# EAGLE schematic haasoscope_pro_input_board (EAGLE 9.6.2)
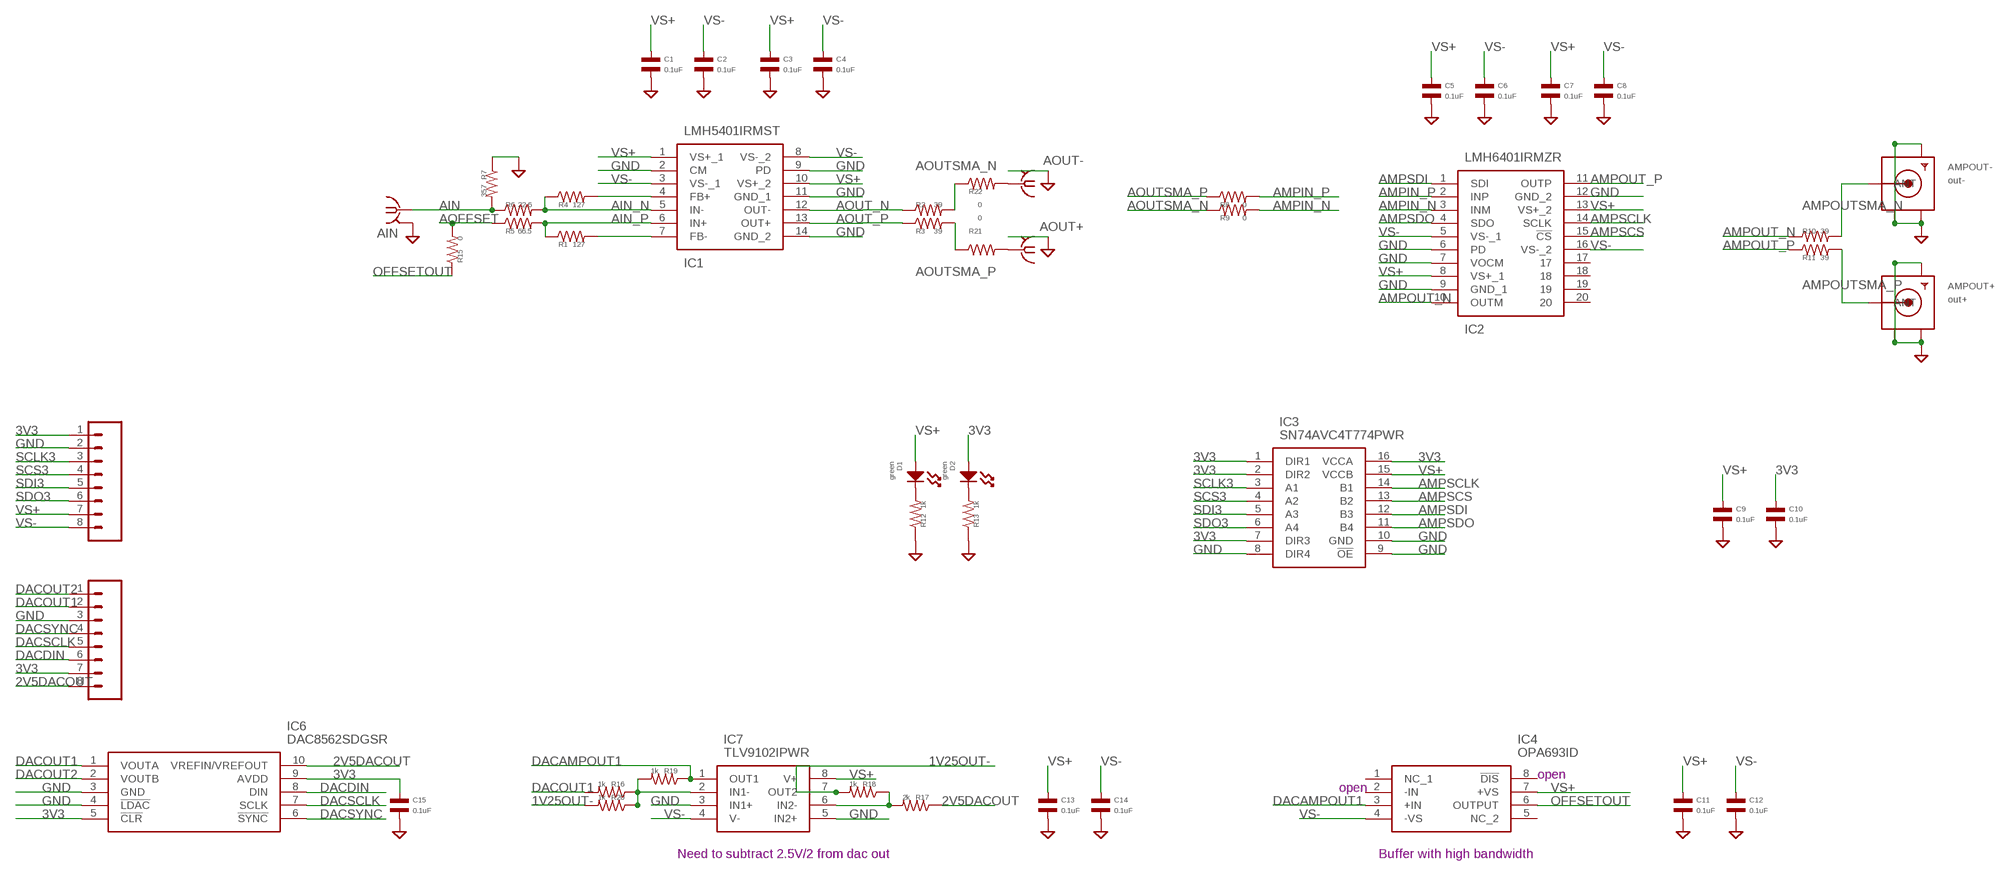
[diagram p0: schematic, sheet 1]

## Parts
AIN  BU-SMB-V  [BU-SMB-V]
AMPOUT+  out+  SMACONNECTOR_EDGE  [SMA_EDGELAUNCH]
AMPOUT-  out-  SMACONNECTOR_EDGE  [SMA_EDGELAUNCH]
AOUT+  BU-SMB-V  [BU-SMB-V]
AOUT-  BU-SMB-V  [BU-SMB-V]
C1  0.1uF  CAPACITOR_NP_0402  [C0402]
C2  0.1uF  CAPACITOR_NP_0402  [C0402]
C3  0.1uF  CAPACITOR_NP_0402  [C0402]
C4  0.1uF  CAPACITOR_NP_0402  [C0402]
C5  0.1uF  CAPACITOR_NP_0402  [C0402]
C6  0.1uF  CAPACITOR_NP_0402  [C0402]
C7  0.1uF  CAPACITOR_NP_0402  [C0402]
C8  0.1uF  CAPACITOR_NP_0402  [C0402]
C9  0.1uF  CAPACITOR_NP_0402  [C0402]
C10  0.1uF  CAPACITOR_NP_0402  [C0402]
C11  0.1uF  CAPACITOR_NP_0402  [C0402]
C12  0.1uF  CAPACITOR_NP_0402  [C0402]
C13  0.1uF  CAPACITOR_NP_0402  [C0402]
C14  0.1uF  CAPACITOR_NP_0402  [C0402]
C15  0.1uF  CAPACITOR_NP_0402  [C0402]
D1  green  LED_SINGLE-0603  [LED0603]
D2  green  LED_SINGLE-0603  [LED0603]
IC1  LMH5401IRMST  [LMH5401IRMSR]
IC2  LMH6401IRMZR  [LMH6401IRMZR]
IC3  SN74AVC4T774PWR  [SOP65P640X120-16N]
IC4  OPA693ID  [SOIC127P600X175-8N]
IC6  DAC8562SDGSR  [SOP50P490X110-10N]
IC7  TLV9102IPWR  [SOP65P640X120-8N]
J1  8pin  CONN_08"  [1X08]
J4  8pin  CONN_08"  [1X08]
R1  127  RESISTOR_0402  [R0402]
R2  39  RESISTOR_0402  [R0402]
R3  39  RESISTOR_0402  [R0402]
R4  127  RESISTOR_0402  [R0402]
R5  66.5  RESISTOR_0402  [R0402]
R6  22.6  RESISTOR_0402  [R0402]
R7  357  RESISTOR_0402  [R0402]
R8  0  RESISTOR_0402  [R0402]
R9  0  RESISTOR_0402  [R0402]
R10  39  RESISTOR_0402  [R0402]
R11  39  RESISTOR_0402  [R0402]
R12  1k  RESISTOR_0402  [R0402]
R13  1k  RESISTOR_0402  [R0402]
R15  0  RESISTOR_0402  [R0402]
R16  1k  RESISTOR_0402  [R0402]
R17  2k  RESISTOR_0402  [R0402]
R18  1k  RESISTOR_0402  [R0402]
R19  1k  RESISTOR_0402  [R0402]
R20  1k  RESISTOR_0402  [R0402]
R21  0  RESISTOR_0402  [R0402]
R22  0  RESISTOR_0402  [R0402]

## Nets
1V25OUT-: IC7.7(OUT2) R18.P$2 R20.P$2
2V5DACOUT: IC6.10(VREFIN/VREFOUT) J1.8 R17.P$1
3V3 [power]: C10.P$1 C15.P$1 D2.ANODE IC3.1(DIR1) IC3.2(DIR2) IC3.7(DIR3) IC3.16(VCCA) IC6.5(!CLR) IC6.9(AVDD) J1.7 J4.1
AIN: AIN.1 R6.P$1 R7.P$2
AIN_N: IC1.5(IN-) R4.P$1 R6.P$2
AIN_P: IC1.6(IN+) R1.P$1 R5.P$2
AMPIN_N: IC2.3(INM) R9.P$2
AMPIN_P: IC2.2(INP) R8.P$2
AMPOUT_N: IC2.10(OUTM) R10.P$1
AMPOUT_P: IC2.11(OUTP) R11.P$1
AMPOUTSMA_N: AMPOUT-.P(ANT) R10.P$2
AMPOUTSMA_P: AMPOUT+.P(ANT) R11.P$2
AMPSCLK: IC2.14(SCLK) IC3.14(B1)
AMPSCS: IC2.15(!CS) IC3.13(B2)
AMPSDI: IC2.1(SDI) IC3.12(B3)
AMPSDO: IC2.4(SDO) IC3.11(B4)
AOFFSET: R5.P$1 R15.P$2
AOUT_N: IC1.12(OUT-) R2.P$1
AOUT_P: IC1.13(OUT+) R3.P$1
AOUTSMA_N: R2.P$2 R9.P$1 R22.P$1
AOUTSMA_P: R3.P$2 R8.P$1 R21.P$1
DACAMPOUT1: IC4.3(+IN) IC7.1(OUT1) R19.P$1
DACDIN: IC6.8(DIN) J1.6
DACOUT1: IC6.1(VOUTA) J1.2 R16.P$2
DACOUT2: IC6.2(VOUTB) J1.1
DACSCLK: IC6.7(SCLK) J1.5
DACSYNC [power]: IC6.6(!SYNC) J1.4
GND: AIN.2 AIN.3 AIN.4 AIN.5 AMPOUT+.GND@1(GND4) AMPOUT+.GND@2(GND3) AMPOUT+.GND@3(GND2) AMPOUT+.GND@4(GND1) AMPOUT-.GND@1(GND4) AMPOUT-.GND@2(GND3) AMPOUT-.GND@3(GND2) AMPOUT-.GND@4(GND1) AOUT+.2 AOUT+.3 AOUT+.4 AOUT+.5 AOUT-.2 AOUT-.3 AOUT-.4 AOUT-.5 C1.P$2 C2.P$2 C3.P$2 C4.P$2 C5.P$2 C6.P$2 C7.P$2 C8.P$2 C9.P$2 C10.P$2 C11.P$2 C12.P$2 C13.P$2 C14.P$2 C15.P$2 IC1.2(CM) IC1.9(PD) IC1.11(GND_1) IC1.14(GND_2) IC2.6(PD) IC2.7(VOCM) IC2.9(GND_1) IC2.12(GND_2) IC3.8(DIR4) IC3.9(!OE) IC3.10(GND) IC6.3(GND) IC6.4(!LDAC) IC7.3(IN1+) IC7.5(IN2+) J1.3 J4.2 R7.P$1 R12.P$1 R13.P$1
N$1: D1.CATHODE R12.P$2
N$2: D2.CATHODE R13.P$2
N$3: IC7.2(IN1-) R16.P$1 R19.P$2 R20.P$1
N$4: AOUT-.1 R22.P$2
N$5: IC7.6(IN2-) R17.P$2 R18.P$1
N$6: AOUT+.1 R21.P$2
N$10: IC1.7(FB-) R1.P$2
N$13: IC1.4(FB+) R4.P$2
OFFSETOUT: IC4.6(OUTPUT) R15.P$1
SCLK3: IC3.3(A1) J4.3
SCS3: IC3.4(A2) J4.4
SDI3: IC3.5(A3) J4.5
SDO3: IC3.6(A4) J4.6
VS+: C1.P$1 C3.P$1 C5.P$1 C7.P$1 C9.P$1 C11.P$1 C13.P$1 D1.ANODE IC1.1(VS+_1) IC1.10(VS+_2) IC2.8(VS+_1) IC2.13(VS+_2) IC3.15(VCCB) IC4.7(+VS) IC7.8(V+) J4.7
VS-: C2.P$1 C4.P$1 C6.P$1 C8.P$1 C12.P$1 C14.P$1 IC1.3(VS-_1) IC1.8(VS-_2) IC2.5(VS-_1) IC2.16(VS-_2) IC4.4(-VS) IC7.4(V-) J4.8
Unconnected: IC2.17 IC2.18 IC2.19 IC2.20 IC4.1(NC_1) IC4.2(-IN) IC4.5(NC_2) IC4.8(!DIS)

## Notes on the sheet
- open
- open
- Need to subtract 2.5V/2 from dac out | Buffer with high bandwidth

## Library data of the parts
AIN AOUT+ AOUT- = con-coax:BU-SMB-V: FEMALE SMB CONNECTOR Radiall distributor RS 112-2993; OC_FARNELL: unknown; OC_NEWARK: unknown
AMPOUT+ AMPOUT- = adafruit:SMACONNECTOR: SMA Connector 90° DIP SMA Connector, 50 Ohm (4UConnector: 07259)
C1-C15 = MF_Passives:CAPACITOR_NP: Library: MF_Passives Description: Device for Non-Polarized Capacitors. Manufacture part number (MPN) can be added via Attributes. Check https://factory.macrofab.com/parts for the house parts list.; POPULATE: 1
D1 D2 = MF_LEDs:LED_SINGLE: Library: MF_LEDs Description: Device for Single LED Packages. Manufacture part number (MFG#) can be added via Attributes.; HOUSEPART: NO; POPULATE: 1
IC1 = LMH5401IRMST:LMH5401IRMST: Texas Instruments LMH5401IRMST, RF Amplifier Differential, 14-Pin UQFN Source: Datasheet <http://www.ti.com/lit/gpn/lmh5401>; DESCRIPTION: Texas Instruments LMH5401IRMST, RF Amplifier Differential, 14-Pin UQFN; HEIGHT: 0.6mm; MANUFACTURER_NAME: Texas Instruments; MANUFACTURER_PART_NUMBER: LMH5401IRMST; MOUSER_PART_NUMBER: 595-LMH5401IRMST; MOUSER_PRICE-STOCK: https://www.mouser.co.uk/ProductDetail/Texas-Instruments/LMH5401IRMST?qs=pV2tVPdcZ6z49pjv7lt75w%3D%3D
IC2 = LMH6401IRMZR:LMH6401IRMZR: Differential Amplifiers 4.5 GHz Ultra Wideband Digital Variable Gain Amplifier 16-UQFN-HR -40 to 85 Source: Datasheet <http://www.ti.com/lit/ds/symlink/lmh6401.pdf>; DESCRIPTION: Differential Amplifiers 4.5 GHz Ultra Wideband Digital Variable Gain Amplifier 16-UQFN-HR -40 to 85; HEIGHT: 0.65mm; MANUFACTURER_NAME: Texas Instruments; MANUFACTURER_PART_NUMBER: LMH6401IRMZR; MOUSER_PART_NUMBER: 595-LMH6401IRMZR; MOUSER_PRICE-STOCK: https://www.mouser.co.uk/ProductDetail/Texas-Instruments/LMH6401IRMZR?qs=zEQ6BYqA5vFvz%252BaadXvvtQ%3D%3D
IC3 = SN74AVC4T774PWR:SN74AVC4T774PWR: 4-Bit Dual-Supply Bus Transceiver With Configurable Voltage-Level Shifting and 3-State Outputs Source: Datasheet <http://www.ti.com/lit/gpn/sn74avc4t774>; DESCRIPTION: 4-Bit Dual-Supply Bus Transceiver With Configurable Voltage-Level Shifting and 3-State Outputs; HEIGHT: 1.2mm; MANUFACTURER_NAME: Texas Instruments; MANUFACTURER_PART_NUMBER: SN74AVC4T774PWR; MOUSER_PART_NUMBER: 595-SN74AVC4T774PWR; MOUSER_PRICE-STOCK: https://www.mouser.co.uk/ProductDetail/Texas-Instruments/SN74AVC4T774PWR?qs=WxL8HmPi5r562Eu%2F2kE2LA%3D%3D
IC4 = OPA693ID:OPA693ID: Ultra-Wideband, Fixed Gain Video Buffer Amplifier with Disable Source: Datasheet <http://www.ti.com/lit/gpn/opa693>; DESCRIPTION: Ultra-Wideband, Fixed Gain Video Buffer Amplifier with Disable; HEIGHT: 1.75mm; MANUFACTURER_NAME: Texas Instruments; MANUFACTURER_PART_NUMBER: OPA693ID; MOUSER_PART_NUMBER: 595-OPA693ID; MOUSER_PRICE-STOCK: https://www.mouser.co.uk/ProductDetail/Texas-Instruments/OPA693ID?qs=wgAEGBTxy7n5Zagrtgs30Q%3D%3D
IC6 = DAC8562SDGSR:DAC8562SDGSR: 16-bit, dual-channel, low-power, ultra-low glitch, voltage output DAC with 2.5V, 4ppm/C reference Source: Datasheet <http://www.ti.com/lit/gpn/dac8562>; DESCRIPTION: 16-bit, dual-channel, low-power, ultra-low glitch, voltage output DAC with 2.5V, 4ppm/C reference; HEIGHT: 1.1mm; MANUFACTURER_NAME: Texas Instruments; MANUFACTURER_PART_NUMBER: DAC8562SDGSR; MOUSER_PART_NUMBER: 595-DAC8562SDGSR; MOUSER_PRICE-STOCK: https://www.mouser.co.uk/ProductDetail/Texas-Instruments/DAC8562SDGSR?qs=L4ss%2FyqpMWQjhHzbOFnTNg%3D%3D
IC7 = TLV9102IPWR:TLV9102IPWR: Dual 1MHz, 16-V rail-to-rail input/output, low-offset voltage, low-power op amp Source: Datasheet <http://www.ti.com/lit/gpn/TLV9102>; DESCRIPTION: Dual 1MHz, 16-V rail-to-rail input/output, low-offset voltage, low-power op amp; HEIGHT: 1.2mm; MANUFACTURER_NAME: Texas Instruments; MANUFACTURER_PART_NUMBER: TLV9102IPWR; MOUSER_PART_NUMBER: 595-TLV9102IPWR; MOUSER_PRICE-STOCK: https://www.mouser.co.uk/ProductDetail/Texas-Instruments/TLV9102IPWR?qs=9r4v7xj2LnnLM2E8pIcWlQ%3D%3D
J1 J4 = SparkFun-Connectors:CONN_08: Multi connection point. Often used as Generic Header-pin footprint for 0.1 inch spaced/style header connections On any of the 0.1 inch spaced packages, you can populate with these: Break Away Headers - Straight <https://www.sparkfun.com/products/116> (PRT-00116) Break Away Male Headers - Right Angle <https://www.sparkfun.com/products/553> (PRT-00553) Female Headers <https://www.sparkfun.com/products/115> (PRT-00115) Break Away Headers - Machine Pin <https://www.sparkfun.com/products/117> (PRT-00117) Break Away Female Headers - Swiss Machine Pin <https://www.sparkfun.com/products/743> (PRT-00743) Arduino Stackable Header - 8 Pin <https://www.sparkfun.com/products/9279> (PRT-09279) For SCREWTERMINALS and SPRING TERMINALS visit here: Screw Terimnals on SparkFun.com <https://www.sparkfun.com/search/results?term=Screw+Terminals> (5mm/3.5mm/2.54mm spacing) This device is also useful as a general connection point to wire up your design to another part of your project. Our various solder wires solder well into these plated through hole pads. Hook-Up Wire - Assortment (Stranded, 22 AWG) <https://www.sparkfun.com/products/11375> (PRT-11375) Hook-Up Wire - Assortment (Solid Core, 22 AWG) <https://www.sparkfun.com/products/11367> (PRT-11367) View the entire wire category on our website here <https://www.sparkfun.com/categories/141> Special notes: Molex polarized connector foot print use with SKU : PRT-08231 with associated crimp pins and housings. 1MM SMD Version SKU: PRT-10208 NOTES ON THE VARIANTS LOCK and LOCK_LONGPADS... This footprint was designed to help hold the alignment of a through-hole component (i.e. 6-pin header) while soldering it into place. You may notice that each hole has been shifted either up or down by 0.005 of an inch from it's more standard position (which is a perfectly straight line). This slight alteration caused the pins (the squares in the middle) to touch the edges of the holes. Because they are alternating, it causes a "brace" to hold the component in place. 0.005 has proven to be the perfect amount of "off-center" position when using our standard breakaway headers. Although looks a little odd when you look at the bare footprint, once you have a header in there, the alteration is very hard to notice. Also,if you push a header all the way into place, it is covered up entirely on the bottom side.; PROD_ID: CONN-08438
R1-R13 R15-R22 = MF_Passives:RESISTOR: Library: MF_Passives Description: Device for Resistors. Manufacture part number (MPN), Voltage, Tolerance, and Wattage Rating can be added via Attributes. Check https://factory.macrofab.com/parts for the house parts list.; POPULATE: 1

## Net classes
0 default: width 0.203 mm
1 power: width 0.152 mm